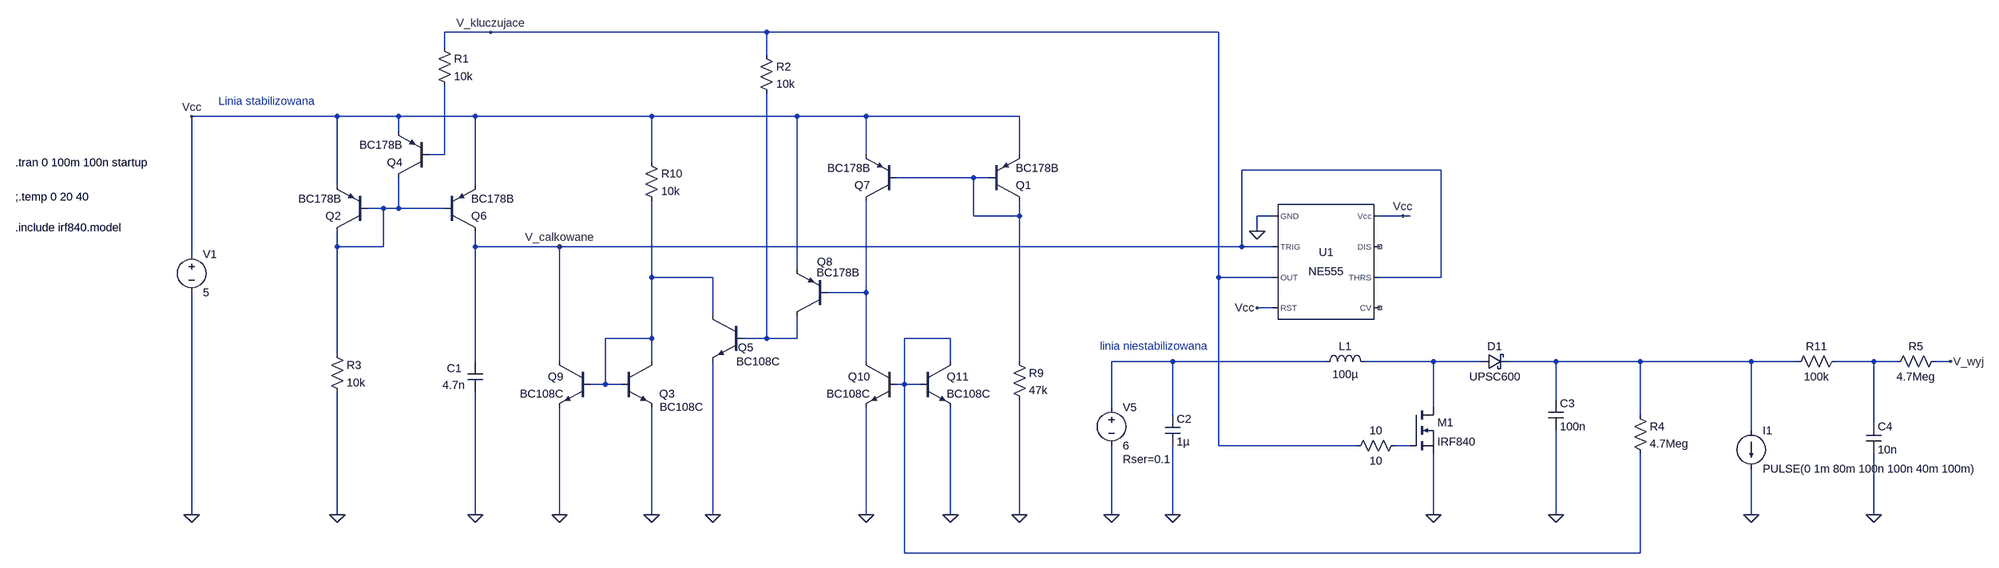
[diagram p0: schematic sekcja_zasilania.asc]
sekcja_zasilania.asc, the LTspice schematic file:
Version 4
SHEET 1 4076 1636
WIRE 656 -160 560 -160
WIRE 1232 -160 656 -160
WIRE 2176 -160 1232 -160
WIRE 560 -128 560 -160
WIRE 1232 -112 1232 -160
WIRE 336 16 32 16
WIRE 464 16 336 16
WIRE 624 16 464 16
WIRE 992 16 624 16
WIRE 1296 16 992 16
WIRE 1440 16 1296 16
WIRE 1760 16 1440 16
WIRE 464 48 464 16
WIRE 560 96 560 -48
WIRE 560 96 528 96
WIRE 1440 96 1440 16
WIRE 1760 96 1760 16
WIRE 992 112 992 16
WIRE 2640 128 2224 128
WIRE 1664 144 1504 144
WIRE 1696 144 1664 144
WIRE 336 160 336 16
WIRE 624 160 624 16
WIRE 432 208 400 208
WIRE 464 208 464 144
WIRE 464 208 432 208
WIRE 560 208 464 208
WIRE 1664 224 1664 144
WIRE 1760 224 1760 192
WIRE 1760 224 1664 224
WIRE 2288 224 2256 224
WIRE 2560 224 2512 224
WIRE 2576 224 2560 224
WIRE 2256 256 2256 224
WIRE 336 288 336 256
WIRE 432 288 432 208
WIRE 432 288 336 288
WIRE 624 288 624 256
WIRE 800 288 624 288
WIRE 2224 288 2224 128
WIRE 2224 288 800 288
WIRE 2288 288 2224 288
WIRE 32 304 32 16
WIRE 1296 336 1296 16
WIRE 992 352 992 192
WIRE 1120 352 992 352
WIRE 2176 352 2176 -160
WIRE 2288 352 2176 352
WIRE 2640 352 2640 128
WIRE 2640 352 2512 352
WIRE 1440 384 1440 192
WIRE 1440 384 1360 384
WIRE 2288 416 2256 416
WIRE 1120 432 1120 352
WIRE 992 480 992 352
WIRE 992 480 896 480
WIRE 1232 480 1232 -32
WIRE 1232 480 1184 480
WIRE 1296 480 1296 432
WIRE 1296 480 1232 480
WIRE 1616 480 1520 480
WIRE 336 512 336 288
WIRE 624 528 624 288
WIRE 800 528 800 288
WIRE 992 528 992 480
WIRE 1440 528 1440 384
WIRE 1616 528 1616 480
WIRE 1760 528 1760 224
WIRE 2080 528 1952 528
WIRE 2400 528 2080 528
WIRE 2624 528 2480 528
WIRE 2720 528 2624 528
WIRE 2880 528 2784 528
WIRE 3056 528 2880 528
WIRE 3344 528 3056 528
WIRE 3440 528 3344 528
WIRE 3600 528 3520 528
WIRE 3648 528 3600 528
WIRE 3760 528 3728 528
WIRE 896 576 896 480
WIRE 896 576 864 576
WIRE 928 576 896 576
WIRE 1520 576 1520 480
WIRE 1520 576 1504 576
WIRE 1552 576 1520 576
WIRE 2880 608 2880 528
WIRE 1952 624 1952 528
WIRE 2624 624 2624 528
WIRE 2080 640 2080 528
WIRE 3056 640 3056 528
WIRE 3600 656 3600 528
WIRE 3344 672 3344 528
WIRE 2176 704 2176 352
WIRE 2464 704 2176 704
WIRE 2576 704 2544 704
WIRE 32 848 32 384
WIRE 336 848 336 592
WIRE 624 848 624 592
WIRE 800 848 800 624
WIRE 992 848 992 624
WIRE 992 848 976 848
WIRE 1120 848 1120 528
WIRE 1440 848 1440 624
WIRE 1616 848 1616 624
WIRE 1616 848 1600 848
WIRE 1760 848 1760 608
WIRE 1952 848 1952 704
WIRE 2080 848 2080 704
WIRE 2624 848 2624 720
WIRE 2880 848 2880 672
WIRE 3344 848 3344 752
WIRE 3600 848 3600 720
WIRE 1520 928 1520 576
WIRE 3056 928 3056 720
WIRE 3056 928 1520 928
FLAG 32 848 0
FLAG 624 848 0
FLAG 336 848 0
FLAG 2256 256 0
FLAG 32 16 Vcc
FLAG 2560 224 Vcc
FLAG 2256 416 Vcc
FLAG 2624 848 0
FLAG 1952 848 0
FLAG 2880 848 0
FLAG 3344 848 0
FLAG 3600 848 0
FLAG 800 848 0
FLAG 992 848 0
FLAG 1120 848 0
FLAG 1760 848 0
FLAG 1440 848 0
FLAG 1616 848 0
FLAG 2080 848 0
FLAG 800 288 V_calkowane
FLAG 656 -160 V_kluczujace
FLAG 3760 528 V_wyj
SYMBOL voltage 32 288 R0
WINDOW 123 0 0 Left 0
WINDOW 39 0 0 Left 0
SYMATTR InstName V1
SYMATTR Value 5
SYMBOL Misc\\NE555 2400 320 R0
SYMATTR InstName U1
SYMBOL cap 608 528 R0
WINDOW 0 -43 14 Left 2
WINDOW 3 -52 49 Left 2
SYMATTR InstName C1
SYMATTR Value 4.7n
SYMBOL res 320 496 R0
SYMATTR InstName R3
SYMATTR Value 10k
SYMBOL nmos 2576 624 R0
SYMATTR InstName M1
SYMATTR Value IRF840
SYMBOL ind 2384 544 R270
WINDOW 0 32 56 VTop 2
WINDOW 3 5 56 VBottom 2
SYMATTR InstName L1
SYMATTR Value 100µ
SYMATTR SpiceLine Rser=0.04
SYMBOL schottky 2720 544 R270
WINDOW 0 32 32 VTop 2
WINDOW 3 0 32 VBottom 2
SYMATTR InstName D1
SYMATTR Value UPSC600
SYMBOL cap 2864 608 R0
SYMATTR InstName C3
SYMATTR Value 100n
SYMBOL voltage 1952 608 R0
WINDOW 123 0 0 Left 0
WINDOW 39 24 124 Left 2
SYMATTR SpiceLine Rser=0.1
SYMATTR InstName V5
SYMATTR Value 6
SYMBOL res 2560 688 R90
WINDOW 0 0 56 VBottom 2
WINDOW 3 32 56 VTop 2
SYMATTR InstName 10
SYMATTR Value 10
SYMBOL current 3344 672 R0
WINDOW 123 0 0 Left 0
WINDOW 39 0 0 Left 0
SYMATTR InstName I1
SYMATTR Value PULSE(0 1m 80m 100n 100n 40m 100m)
SYMBOL cap 3584 656 R0
SYMATTR InstName C4
SYMATTR Value 10n
SYMBOL res 3536 512 R90
WINDOW 0 0 56 VBottom 2
WINDOW 3 32 56 VTop 2
SYMATTR InstName R11
SYMATTR Value 100k
SYMBOL res 3040 624 R0
SYMATTR InstName R4
SYMATTR Value 4.7Meg
SYMBOL npn 864 528 M0
SYMATTR InstName Q9
SYMATTR Value BC108C
SYMBOL res 976 96 R0
SYMATTR InstName R10
SYMATTR Value 10k
SYMBOL pnp 1504 192 R180
SYMATTR InstName Q7
SYMATTR Value BC178B
SYMBOL res 1744 512 R0
SYMATTR InstName R9
SYMATTR Value 47k
SYMBOL cap 2064 640 R0
SYMATTR InstName C2
SYMATTR Value 1µ
SYMBOL res 1216 -128 R0
SYMATTR InstName R2
SYMATTR Value 10k
SYMBOL res 544 -144 R0
SYMATTR InstName R1
SYMATTR Value 10k
SYMBOL npn 928 528 R0
WINDOW 0 80 68 Left 2
WINDOW 3 81 95 Left 2
SYMATTR InstName Q3
SYMATTR Value BC108C
SYMBOL npn 1184 432 M0
WINDOW 0 -21 67 Left 2
WINDOW 3 -76 96 Left 2
SYMATTR InstName Q5
SYMATTR Value BC108C
SYMBOL npn 1504 528 M0
SYMATTR InstName Q10
SYMATTR Value BC108C
SYMBOL npn 1552 528 R0
SYMATTR InstName Q11
SYMATTR Value BC108C
SYMBOL pnp 1696 192 M180
SYMATTR InstName Q1
SYMATTR Value BC178B
SYMBOL pnp 400 256 R180
SYMATTR InstName Q2
SYMATTR Value BC178B
SYMBOL pnp 528 144 R180
SYMATTR InstName Q4
SYMATTR Value BC178B
SYMBOL pnp 560 256 M180
SYMATTR InstName Q6
SYMATTR Value BC178B
SYMBOL pnp 1360 432 R180
WINDOW 0 -10 112 Left 2
WINDOW 3 -66 90 Left 2
SYMATTR InstName Q8
SYMATTR Value BC178B
SYMBOL res 3744 512 R90
WINDOW 0 0 56 VBottom 2
WINDOW 3 32 56 VTop 2
SYMATTR InstName R5
SYMATTR Value 4.7Meg
TEXT -336 112 Left 2 !.tran 0 100m 100n startup
TEXT -336 184 Left 2 !;.temp 0 20 40
TEXT -336 248 Left 2 !.include irf840.model
TEXT 88 -16 Left 2 ;Linia stabilizowana
TEXT 1928 496 Left 2 ;linia niestabilizowana

The netlist it stands for:
* sekcja_zasilania.asc
V1 Vcc 0 5
XU1 0 V_calkowane V_kluczujace Vcc NC_01 V_calkowane NC_02 Vcc NE555  ; pins GND TRIG OUT RST CV THRS DIS Vcc
C1 V_calkowane 0 4.7n
R3 N003 0 10k
M1 N009 N012 0 0 IRF840
L1 N008 N009 100µ Rser=0.04
D1 N009 N010 UPSC600
C3 N010 0 100n
V5 N008 0 6 Rser=0.1
R§10 N012 V_kluczujace 10
I1 N010 0 PULSE(0 1m 80m 100n 100n 40m 100m)
C4 N011 0 10n
R11 N011 N010 100k
R4 N010 N007 4.7Meg
Q9 V_calkowane N004 0 0 BC108C
R10 Vcc N004 10k
Q7 N005 N002 Vcc 0 BC178B
R9 N002 0 47k
C2 N008 0 1µ
R2 V_kluczujace N006 10k
R1 V_kluczujace N001 10k
Q3 N004 N004 0 0 BC108C
Q5 N004 N006 0 0 BC108C
Q10 N005 N007 0 0 BC108C
Q11 N007 N007 0 0 BC108C
Q1 N002 N002 Vcc 0 BC178B
Q2 N003 N003 Vcc 0 BC178B
Q4 N003 N001 Vcc 0 BC178B
Q6 V_calkowane N003 Vcc 0 BC178B
Q8 N006 N005 Vcc 0 BC178B
R5 V_wyj N011 4.7Meg
.model D D
.lib standard.dio
.model NPN NPN
.model PNP PNP
.lib standard.bjt
.model NMOS NMOS
.model PMOS PMOS
.lib standard.mos
.tran 0 100m 100n startup
;.temp 0 20 40
.include irf840.model
* Linia stabilizowana
* linia niestabilizowana
.lib NE555.sub
.backanno
.end